# Altium schematic sheet Rail Protection.SchDoc
size Letter
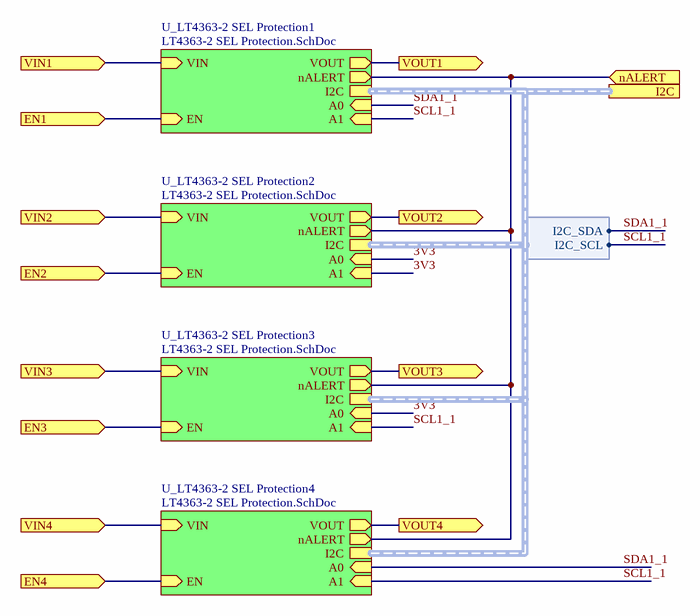
[diagram p0: Rail Protection.SchDoc]

## Sub-sheets
U_LT4363-2 SEL Protection1 = LT4363-2 SEL Protection.SchDoc: VIN (in), VOUT (out), I2C (harness INA226_I2C), A0 (in), A1 (in), EN (in), nALERT (out)
U_LT4363-2 SEL Protection2 = LT4363-2 SEL Protection.SchDoc: VIN (in), VOUT (out), I2C (harness INA226_I2C), A0 (in), A1 (in), EN (in), nALERT (out)
U_LT4363-2 SEL Protection3 = LT4363-2 SEL Protection.SchDoc: VIN (in), VOUT (out), I2C (harness INA226_I2C), A0 (in), A1 (in), EN (in), nALERT (out)
U_LT4363-2 SEL Protection4 = LT4363-2 SEL Protection.SchDoc: VIN (in), VOUT (out), I2C (harness INA226_I2C), A0 (in), A1 (in), EN (in), nALERT (out)

## Ports
EN1 (in), EN2 (in), EN3 (in), EN4 (in), I2C (harness INA226_I2C), nALERT (in), VIN1 (in), VIN2 (in), VIN3 (in), VIN4 (in), VOUT1 (out), VOUT2 (out), VOUT3 (out), VOUT4 (out)

## Harnesses
INA226_I2C: I2C_SCL, I2C_SDA

## Nets
3V3: sheet U_LT4363-2 SEL Protection2/A0, sheet U_LT4363-2 SEL Protection2/A1, sheet U_LT4363-2 SEL Protection3/A0
EN1: port EN1, sheet U_LT4363-2 SEL Protection1/EN
EN2: port EN2, sheet U_LT4363-2 SEL Protection2/EN
EN3: port EN3, sheet U_LT4363-2 SEL Protection3/EN
EN4: port EN4, sheet U_LT4363-2 SEL Protection4/EN
nALERT: port nALERT, sheet U_LT4363-2 SEL Protection1/nALERT, sheet U_LT4363-2 SEL Protection2/nALERT, sheet U_LT4363-2 SEL Protection3/nALERT, sheet U_LT4363-2 SEL Protection4/nALERT
SCL1_1: sheet U_LT4363-2 SEL Protection1/A1, sheet U_LT4363-2 SEL Protection3/A1, sheet U_LT4363-2 SEL Protection4/A1, port I2C.I2C_SCL
SDA1_1: sheet U_LT4363-2 SEL Protection1/A0, sheet U_LT4363-2 SEL Protection4/A0, port I2C.I2C_SDA
VIN1: port VIN1, sheet U_LT4363-2 SEL Protection1/VIN
VIN2: port VIN2, sheet U_LT4363-2 SEL Protection2/VIN
VIN3: port VIN3, sheet U_LT4363-2 SEL Protection3/VIN
VIN4: port VIN4, sheet U_LT4363-2 SEL Protection4/VIN
VOUT1: port VOUT1, sheet U_LT4363-2 SEL Protection1/VOUT
VOUT2: port VOUT2, sheet U_LT4363-2 SEL Protection2/VOUT
VOUT3: port VOUT3, sheet U_LT4363-2 SEL Protection3/VOUT
VOUT4: port VOUT4, sheet U_LT4363-2 SEL Protection4/VOUT

## Buses and harness runs
harness port I2C = sheet U_LT4363-2 SEL Protection1/I2C = sheet U_LT4363-2 SEL Protection2/I2C = sheet U_LT4363-2 SEL Protection3/I2C = sheet U_LT4363-2 SEL Protection4/I2C

## Notes on the sheet
- (the "License"); you may not use or redistribute this file except in compliance with the License. You
- This file and the information within it are licensed under the terms of the Apache License, Version 2.0
- Copyright
- Unless required by applicable law or agreed to in writing, content distributed under the License is
- distributed on an "AS IS" BASIS, WITHOUT WARRANTIES OR CONDITIONS OF ANY KIND,
- either express or implied. See the License for the specific language governing permissions and
- limitations under the License.
- may obtain a copy of the License at:
- http://www.apache.org/licenses/LICENSE-2.0
- Title
- Size:
- Date:
- Letter
- Number:
- Time:
- Revision:
- Sheet
- of
- University of Alberta
- Deptartment of Electrical
- and Computer Engineering
- Edmonton AB, Canada
- T6G 1H9
- File: